# Altium schematic sheet Diapositivas.SchDoc
size A4
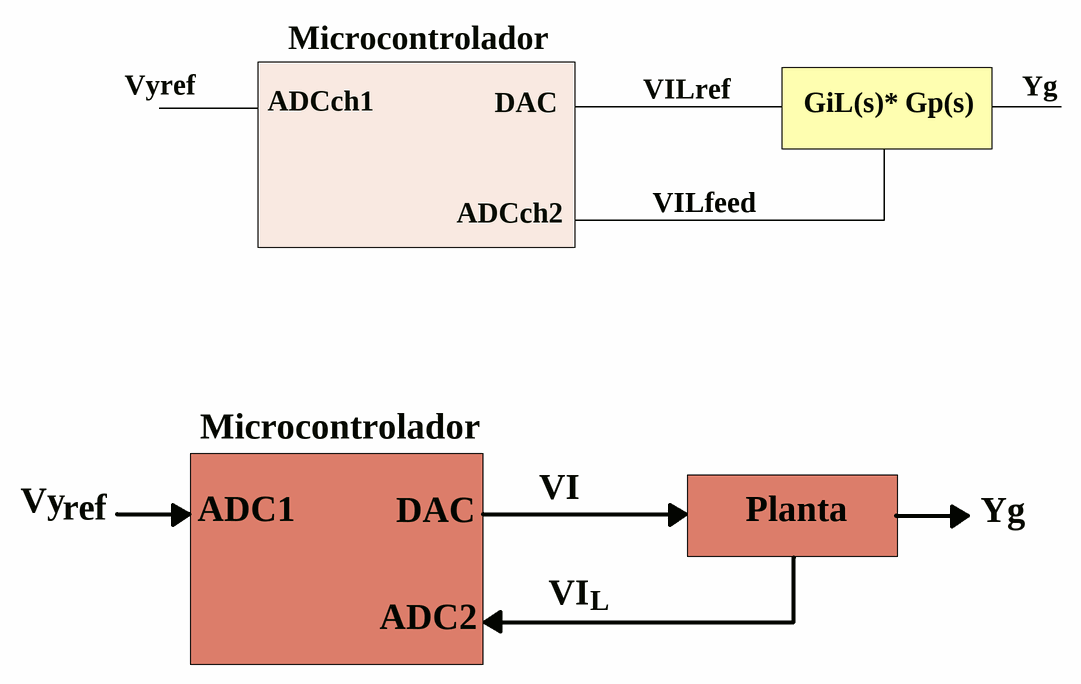
[diagram p0: Diapositivas.SchDoc]

## Notes on the sheet
- Microcontrolador
- Vyref
- ADCch1
- DAC
- VILref
- GiL(s)*
- Gp(s)
- Yg
- ADCch2
- VILfeed
- Vy
- ref
- ADC1
- VI
- Planta
- ADC2
- L